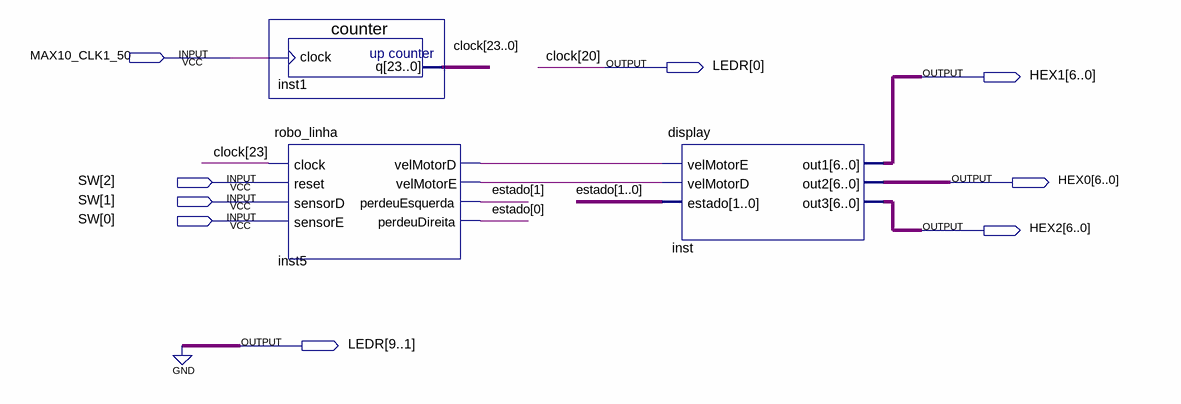
[diagram p0: schematic sheet]
// Quartus schematic robo_linha.bdf as structural Verilog: 3 symbols, 9 pins
module robo_linha (
  input  MAX10_CLK1_50,
  input  [2:0] SW,
  output [9:0] LEDR,
  output [6:0] HEX1,
  output [6:0] HEX0,
  output [6:0] HEX2
);

  wire inst5_velmotord, inst5_velmotore;
  wire [1:0] estado;
  wire [23:0] clock;

  counter inst1 (.clock(MAX10_CLK1_50), .q({clock[23:21], LEDR[0], clock[19:0]}));
  robo_linha inst5 (
    .clock(clock[23]), .velMotorD(inst5_velmotord), .velMotorE(inst5_velmotore), .perdeuEsquerda(estado[1]),
    .perdeuDireita(estado[0]));  // open: reset, sensorD, sensorE
  display inst (
    .velMotorE(inst5_velmotord), .velMotorD(inst5_velmotore), .estado(estado), .out1(HEX1), .out2(HEX0),
    .out3(HEX2));

  assign LEDR[9:1] = {9{1'b0}};

  // Other names for the same wires on the sheet: clock[20] = LEDR[0]
endmodule
